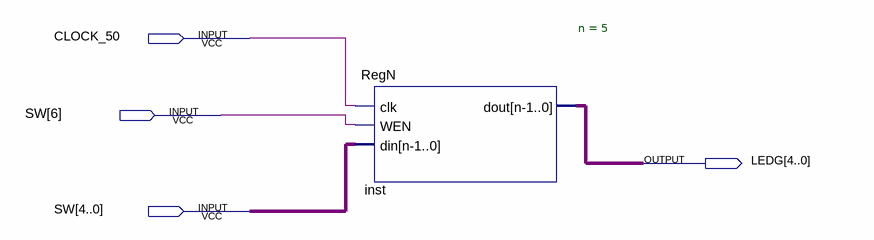
[diagram p0: schematic sheet]
// Quartus schematic Block6.bdf as structural Verilog: 1 symbols, 4 pins
module Block6 (
  input  CLOCK_50,
  input  [6:0] SW,
  output [4:0] LEDG
);

  RegN #(.n(5)) inst (.clk(CLOCK_50), .WEN(SW[6]), .din(SW[4:0]), .dout(LEDG));
endmodule
